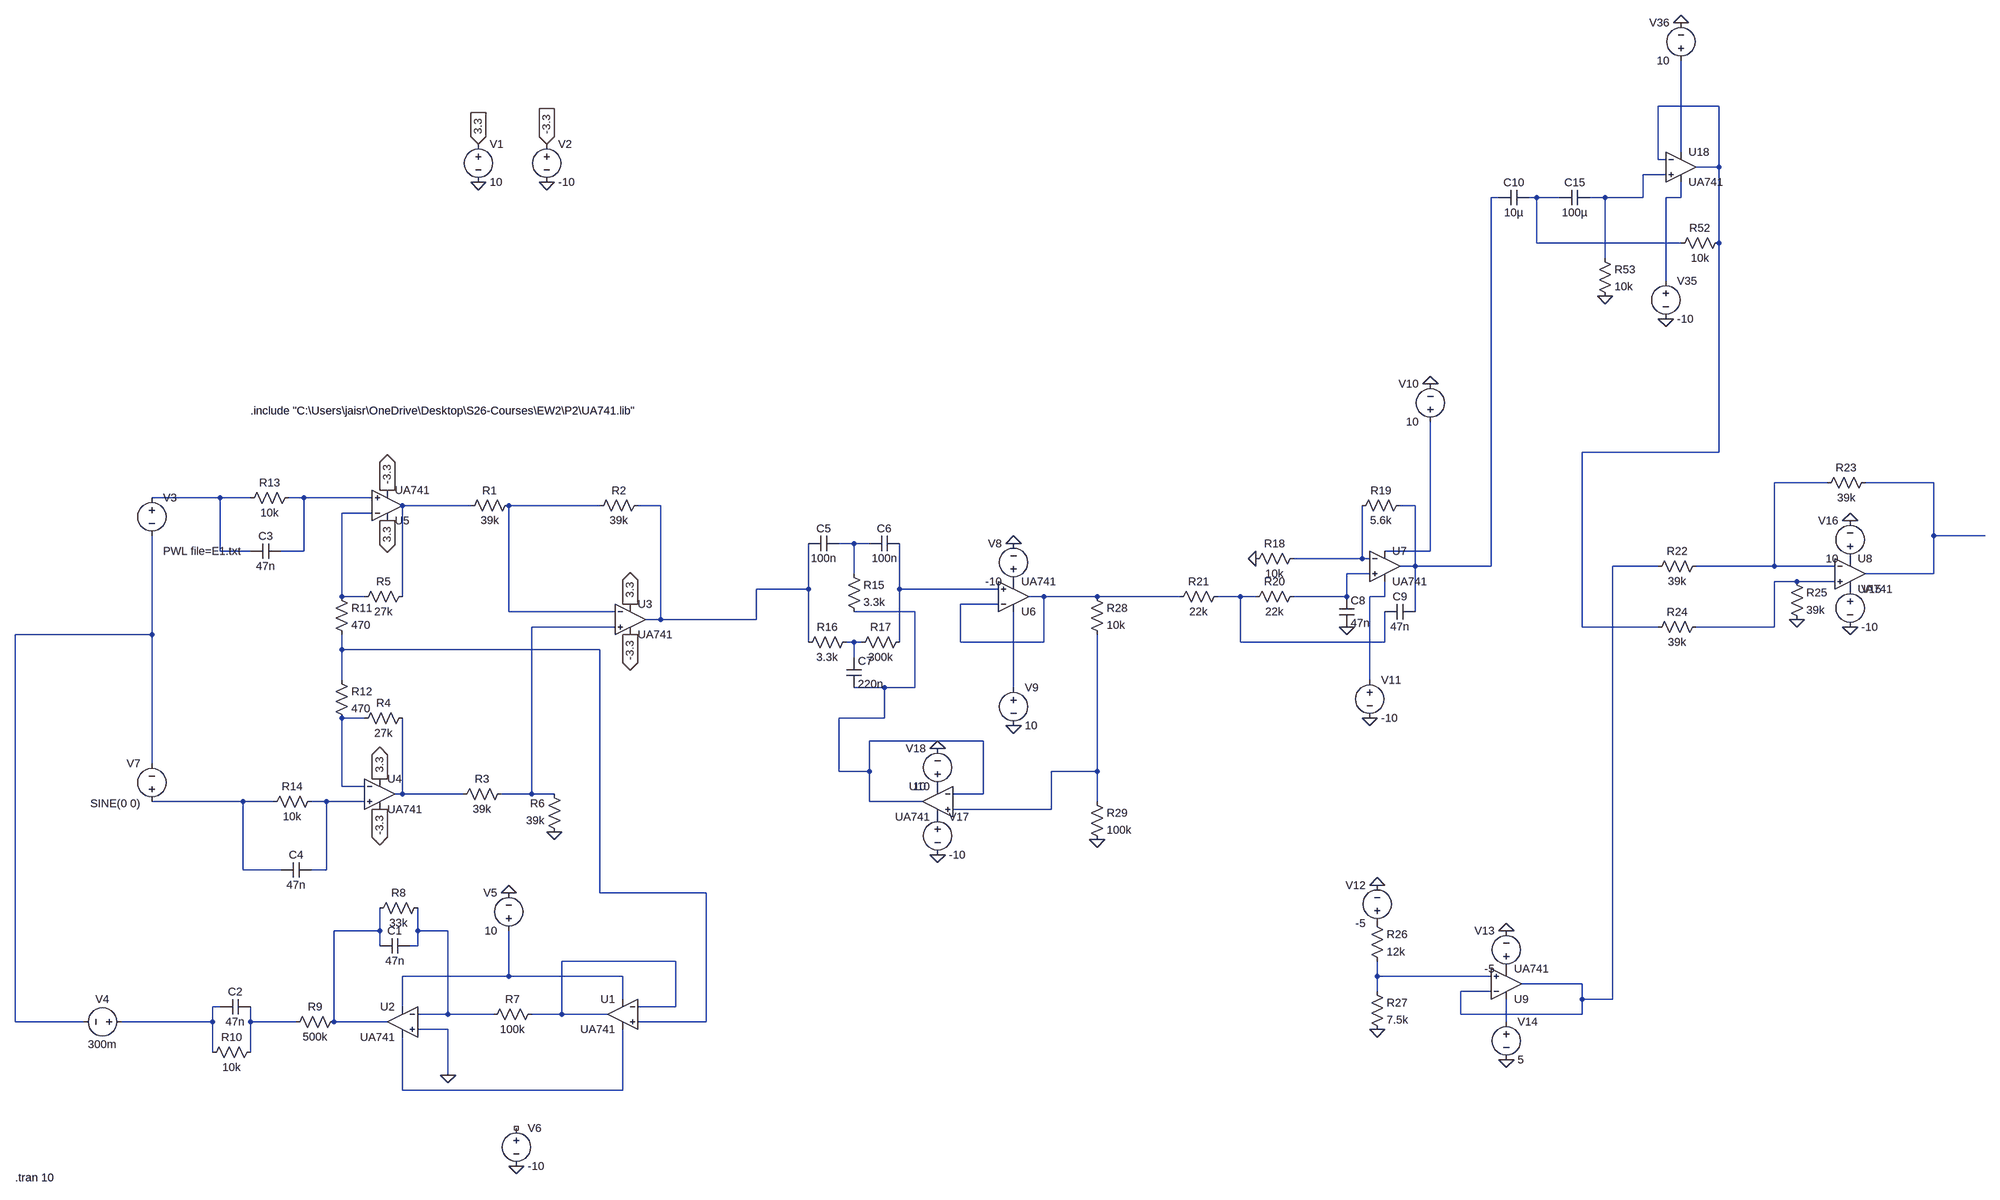
[diagram p0: schematic final ckt UA741.asc]
final ckt UA741.asc, the LTspice schematic file:
Version 4.1
SHEET 1 8580 3172
WIRE 4432 -1200 4304 -1200
WIRE 4352 -1104 4352 -1296
WIRE 4304 -1088 4304 -1200
WIRE 4320 -1088 4304 -1088
WIRE 4432 -1072 4432 -1200
WIRE 4432 -1072 4384 -1072
WIRE 4320 -1056 4272 -1056
WIRE 3968 -1008 3952 -1008
WIRE 4048 -1008 4032 -1008
WIRE 4096 -1008 4048 -1008
WIRE 4192 -1008 4160 -1008
WIRE 4272 -1008 4272 -1056
WIRE 4272 -1008 4192 -1008
WIRE 4352 -1008 4352 -1040
WIRE 4352 -1008 4320 -1008
WIRE 4048 -912 4048 -1008
WIRE 4352 -912 4048 -912
WIRE 4432 -912 4432 -1072
WIRE 4192 -880 4192 -1008
WIRE 4320 -832 4320 -1008
WIRE 4432 -336 4432 -912
WIRE 4432 -336 4144 -336
WIRE 4672 -272 4560 -272
WIRE 4896 -272 4752 -272
WIRE -816 -240 -960 -240
WIRE -752 -240 -816 -240
WIRE -640 -240 -672 -240
WIRE -496 -240 -640 -240
WIRE -288 -224 -432 -224
WIRE -16 -224 -208 -224
WIRE 112 -224 64 -224
WIRE 3792 -224 3760 -224
WIRE -496 -208 -560 -208
WIRE 4896 -160 4896 -272
WIRE 5456 -160 4896 -160
WIRE 2048 -144 2016 -144
WIRE 2080 -144 2048 -144
WIRE -816 -128 -816 -240
WIRE -752 -128 -816 -128
WIRE -640 -128 -640 -240
WIRE -640 -128 -688 -128
WIRE 3824 -128 3824 -400
WIRE 3824 -128 3728 -128
WIRE 3680 -112 3680 -224
WIRE 3680 -112 3536 -112
WIRE 3696 -112 3680 -112
WIRE 3792 -96 3792 -224
WIRE 3792 -96 3760 -96
WIRE 3952 -96 3952 -1008
WIRE 3952 -96 3792 -96
WIRE 4304 -96 4208 -96
WIRE 4560 -96 4560 -272
WIRE 4560 -96 4384 -96
WIRE 4688 -96 4560 -96
WIRE 2048 -80 2048 -144
WIRE 3696 -80 3648 -80
WIRE 4896 -80 4896 -160
WIRE 4896 -80 4752 -80
WIRE 4608 -64 4560 -64
WIRE 4688 -64 4608 -64
WIRE 1952 -48 1952 -144
WIRE 1952 -48 1024 -48
WIRE 2144 -48 2144 -144
WIRE 2352 -48 2144 -48
WIRE -560 -32 -560 -208
WIRE -512 -32 -560 -32
WIRE -432 -32 -432 -224
WIRE 2448 -32 2416 -32
WIRE 2560 -32 2448 -32
WIRE 3296 -32 2560 -32
WIRE 3424 -32 3376 -32
WIRE 3456 -32 3424 -32
WIRE 3648 -32 3648 -80
WIRE 3648 -32 3536 -32
WIRE 3728 -32 3728 -64
WIRE 3728 -32 3696 -32
WIRE 2352 -16 2272 -16
WIRE -208 0 -208 -224
WIRE 16 0 -208 0
WIRE 2176 0 2048 0
WIRE 3792 0 3792 -96
WIRE 112 16 112 -224
WIRE 112 16 80 16
WIRE 1024 16 1024 -48
WIRE 1024 16 112 16
WIRE 16 32 -160 32
WIRE 4144 32 4144 -336
WIRE 4304 32 4144 32
WIRE 4560 32 4560 -64
WIRE 4560 32 4384 32
WIRE -960 48 -960 -160
WIRE -960 48 -1248 48
WIRE 1952 64 1952 -48
WIRE 2048 64 2032 64
WIRE 2064 64 2048 64
WIRE 2144 64 2144 -48
WIRE 2272 64 2272 -16
WIRE 2448 64 2448 -32
WIRE 2448 64 2272 64
WIRE 3424 64 3424 -32
WIRE 3728 64 3728 0
WIRE 3728 64 3424 64
WIRE -560 80 -560 48
WIRE -16 80 -560 80
WIRE 2048 96 2048 64
WIRE -560 144 -560 80
WIRE 3696 144 3696 -32
WIRE 2112 160 2048 160
WIRE 2176 160 2176 0
WIRE 2176 160 2112 160
WIRE 2384 160 2384 0
WIRE -512 224 -560 224
WIRE 2112 224 2112 160
WIRE 2112 224 2016 224
WIRE 2320 272 2080 272
WIRE -960 320 -960 48
WIRE 2016 336 2016 224
WIRE 2080 336 2080 272
WIRE 2080 336 2016 336
WIRE 2560 336 2560 48
WIRE 2560 336 2464 336
WIRE -560 368 -560 224
WIRE -512 368 -560 368
WIRE -432 384 -432 224
WIRE -432 384 -448 384
WIRE -304 384 -432 384
WIRE -160 384 -160 32
WIRE -160 384 -224 384
WIRE -112 384 -160 384
WIRE 2320 384 2320 272
WIRE 2320 384 2256 384
WIRE -768 400 -960 400
WIRE -704 400 -768 400
WIRE -592 400 -624 400
WIRE -512 400 -592 400
WIRE 2080 400 2080 336
WIRE 2192 400 2080 400
WIRE 2560 400 2560 336
WIRE 2464 416 2464 336
WIRE 2464 416 2256 416
WIRE -768 544 -768 400
WIRE -688 544 -768 544
WIRE -592 544 -592 400
WIRE -592 544 -624 544
WIRE -16 592 -16 80
WIRE 208 592 -16 592
WIRE -480 672 -480 624
WIRE -480 672 -576 672
WIRE -400 672 -400 624
WIRE -336 672 -400 672
WIRE -480 704 -480 672
WIRE -400 704 -400 672
WIRE -400 704 -416 704
WIRE 144 736 -96 736
WIRE -208 768 -208 672
WIRE -208 768 -432 768
WIRE 32 768 -208 768
WIRE 3712 768 3712 736
WIRE 3952 768 3712 768
WIRE 4144 784 4016 784
WIRE 3712 800 3712 768
WIRE 3952 800 3888 800
WIRE 32 816 32 768
WIRE 4144 816 4144 784
WIRE 4208 816 4208 -96
WIRE 4208 816 4144 816
WIRE -816 832 -832 832
WIRE -432 832 -432 768
WIRE 144 832 144 736
WIRE 144 832 64 832
WIRE -336 848 -336 672
WIRE -336 848 -400 848
WIRE -240 848 -336 848
WIRE -96 848 -96 736
WIRE -96 848 -160 848
WIRE 0 848 -96 848
WIRE 3888 848 3888 800
WIRE 4144 848 4144 816
WIRE 4144 848 3888 848
WIRE -1248 864 -1248 48
WIRE -1104 864 -1248 864
WIRE -832 864 -832 832
WIRE -832 864 -1024 864
WIRE -752 864 -752 832
WIRE -656 864 -752 864
WIRE -576 864 -576 672
WIRE -464 864 -576 864
WIRE 208 864 208 592
WIRE 208 864 64 864
WIRE 3984 864 3984 816
WIRE -336 880 -400 880
WIRE -832 928 -832 864
WIRE -752 928 -752 864
WIRE -336 976 -336 880
WIRE -432 1008 -432 896
WIRE 32 1008 32 880
WIRE 32 1008 -432 1008
FLAG -272 -1040 0
FLAG -128 -1040 0
FLAG -272 -1120 3.3
IOPIN -272 -1120 In
FLAG -128 -1120 -3.3
IOPIN -128 -1120 In
FLAG -112 464 0
FLAG -464 -192 3.3
IOPIN -464 -192 Out
FLAG -480 352 3.3
IOPIN -480 352 Out
FLAG -464 -256 -3.3
IOPIN -464 -256 Out
FLAG -480 416 -3.3
IOPIN -480 416 Out
FLAG 48 -16 3.3
IOPIN 48 -16 Out
FLAG 48 48 -3.3
IOPIN 48 48 Out
FLAG -336 976 0
FLAG -192 1168 0
FLAG -208 592 0
FLAG 2384 240 0
FLAG 2384 -144 0
FLAG 2560 480 0
FLAG 2224 512 0
FLAG 2224 288 0
FLAG 3648 32 0
FLAG 3456 -112 0
FLAG 3696 224 0
FLAG 3824 -480 0
FLAG 4608 16 0
FLAG 3712 880 0
FLAG 3712 576 0
FLAG 3984 944 0
FLAG 3984 672 0
FLAG 4720 -192 0
FLAG 4720 32 0
FLAG 4320 -752 0
FLAG 4352 -1376 0
FLAG 4192 -800 0
SYMBOL voltage -272 -1136 R0
WINDOW 123 0 0 Left 0
WINDOW 39 0 0 Left 0
SYMATTR InstName V1
SYMATTR Value 10
SYMBOL voltage -128 -1136 R0
WINDOW 123 0 0 Left 0
WINDOW 39 0 0 Left 0
SYMATTR InstName V2
SYMATTR Value -10
SYMBOL res -192 -240 R90
WINDOW 0 0 56 VBottom 2
WINDOW 3 32 56 VTop 2
SYMATTR InstName R1
SYMATTR Value 39k
SYMBOL res 80 -240 R90
WINDOW 0 0 56 VBottom 2
WINDOW 3 32 56 VTop 2
SYMATTR InstName R2
SYMATTR Value 39k
SYMBOL res -208 368 R90
WINDOW 0 0 56 VBottom 2
WINDOW 3 32 56 VTop 2
SYMATTR InstName R3
SYMATTR Value 39k
SYMBOL res -416 208 R90
WINDOW 0 0 56 VBottom 2
WINDOW 3 32 56 VTop 2
SYMATTR InstName R4
SYMATTR Value 27k
SYMBOL res -416 -48 R90
WINDOW 0 0 56 VBottom 2
WINDOW 3 32 56 VTop 2
SYMATTR InstName R5
SYMATTR Value 27k
SYMBOL res -96 480 R180
WINDOW 0 36 76 Left 2
WINDOW 3 36 40 Left 2
SYMATTR InstName R6
SYMATTR Value 39k
SYMBOL voltage -960 -256 R0
WINDOW 123 24 100 Left 2
WINDOW 39 0 0 Left 0
WINDOW 3 24 128 Left 2
SYMATTR Value PWL file=E1.txt
SYMATTR InstName V3
SYMBOL OpAmps\\opamp2 32 784 M0
SYMATTR InstName U1
SYMATTR Value UA741
SYMBOL OpAmps\\opamp2 -432 800 M0
SYMATTR InstName U2
SYMATTR Value UA741
SYMBOL res -144 832 R90
WINDOW 0 0 56 VBottom 2
WINDOW 3 32 56 VTop 2
SYMATTR InstName R7
SYMATTR Value 100k
SYMBOL cap -416 688 R90
WINDOW 0 0 32 VBottom 2
WINDOW 3 32 32 VTop 2
SYMATTR InstName C1
SYMATTR Value 47n
SYMBOL res -384 608 R90
WINDOW 0 0 56 VBottom 2
WINDOW 3 32 56 VTop 2
SYMATTR InstName R8
SYMATTR Value 33k
SYMBOL res -560 848 R90
WINDOW 0 0 56 VBottom 2
WINDOW 3 32 56 VTop 2
SYMATTR InstName R9
SYMATTR Value 500k
SYMBOL cap -752 816 R90
WINDOW 0 0 32 VBottom 2
WINDOW 3 32 32 VTop 2
SYMATTR InstName C2
SYMATTR Value 47n
SYMBOL res -736 912 R90
WINDOW 0 0 56 VBottom 2
WINDOW 3 32 56 VTop 2
SYMATTR InstName R10
SYMATTR Value 10k
SYMBOL voltage -1008 864 R90
WINDOW 0 -32 56 VBottom 2
WINDOW 3 32 56 VTop 2
WINDOW 123 0 0 Left 0
WINDOW 39 0 0 Left 0
SYMATTR InstName V4
SYMATTR Value 300m
SYMBOL voltage -208 688 R180
WINDOW 0 24 96 Left 2
WINDOW 3 24 16 Left 2
WINDOW 123 0 0 Left 0
WINDOW 39 0 0 Left 0
SYMATTR InstName V5
SYMATTR Value 10
SYMBOL voltage -192 1072 R0
WINDOW 123 0 0 Left 0
WINDOW 39 0 0 Left 0
SYMATTR InstName V6
SYMATTR Value -10
SYMBOL res -576 -48 R0
SYMATTR InstName R11
SYMATTR Value 470
SYMBOL res -576 128 R0
SYMATTR InstName R12
SYMATTR Value 470
SYMBOL res -656 -256 R90
WINDOW 0 0 56 VBottom 2
WINDOW 3 32 56 VTop 2
SYMATTR InstName R13
SYMATTR Value 10k
SYMBOL res -608 384 R90
WINDOW 0 0 56 VBottom 2
WINDOW 3 32 56 VTop 2
SYMATTR InstName R14
SYMATTR Value 10k
SYMBOL cap -688 -144 R90
WINDOW 0 0 32 VBottom 2
WINDOW 3 32 32 VTop 2
SYMATTR InstName C3
SYMATTR Value 47n
SYMBOL cap -624 528 R90
WINDOW 0 0 32 VBottom 2
WINDOW 3 32 32 VTop 2
SYMATTR InstName C4
SYMATTR Value 47n
SYMBOL voltage -960 416 R180
WINDOW 0 24 96 Left 2
WINDOW 3 24 12 Left 2
WINDOW 123 24 40 Left 2
WINDOW 39 0 0 Left 0
SYMATTR InstName V7
SYMATTR Value SINE(0 0)
SYMBOL cap 2016 -160 R90
WINDOW 0 0 32 VBottom 2
WINDOW 3 32 32 VTop 2
SYMATTR InstName C5
SYMATTR Value 100n
SYMBOL cap 2144 -160 R90
WINDOW 0 0 32 VBottom 2
WINDOW 3 32 32 VTop 2
SYMATTR InstName C6
SYMATTR Value 100n
SYMBOL res 2032 -96 R0
SYMATTR InstName R15
SYMATTR Value 3.3k
SYMBOL res 2048 48 R90
WINDOW 0 0 56 VBottom 2
WINDOW 3 32 56 VTop 2
SYMATTR InstName R16
SYMATTR Value 3.3k
SYMBOL res 2160 48 R90
WINDOW 0 0 56 VBottom 2
WINDOW 3 32 56 VTop 2
SYMATTR InstName R17
SYMATTR Value 300k
SYMBOL cap 2032 96 R0
SYMATTR InstName C7
SYMATTR Value 220n
SYMBOL voltage 2384 -48 R180
WINDOW 0 24 96 Left 2
WINDOW 3 24 16 Left 2
WINDOW 123 0 0 Left 0
WINDOW 39 0 0 Left 0
SYMATTR InstName V8
SYMATTR Value -10
SYMBOL voltage 2384 144 R0
WINDOW 123 0 0 Left 0
WINDOW 39 0 0 Left 0
SYMATTR InstName V9
SYMATTR Value 10
SYMBOL OpAmps\\opamp2 -480 320 R0
SYMATTR InstName U4
SYMATTR Value UA741
SYMBOL OpAmps\\opamp2 -464 -160 M180
SYMATTR InstName U5
SYMATTR Value UA741
SYMBOL OpAmps\\opamp2 48 -48 R0
SYMATTR InstName U3
SYMATTR Value UA741
SYMBOL OpAmps\\opamp2 2384 32 M180
SYMATTR InstName U6
SYMATTR Value UA741
SYMBOL res 2544 -48 R0
SYMATTR InstName R28
SYMATTR Value 10k
SYMBOL res 2544 384 R0
SYMATTR InstName R29
SYMATTR Value 100k
SYMBOL OpAmps\\opamp2 2224 336 M0
SYMATTR InstName U10
SYMATTR Value UA741
SYMBOL voltage 2224 416 R0
WINDOW 123 0 0 Left 0
WINDOW 39 0 0 Left 0
SYMATTR InstName V17
SYMATTR Value -10
SYMBOL voltage 2224 384 R180
WINDOW 0 24 96 Left 2
WINDOW 3 24 16 Left 2
WINDOW 123 0 0 Left 0
WINDOW 39 0 0 Left 0
SYMATTR InstName V18
SYMATTR Value 10
SYMBOL OpAmps\\opamp2 3728 -160 R0
SYMATTR InstName U7
SYMATTR Value UA741
SYMBOL res 3552 -128 R90
WINDOW 0 0 56 VBottom 2
WINDOW 3 32 56 VTop 2
SYMATTR InstName R18
SYMATTR Value 10k
SYMBOL res 3776 -240 R90
WINDOW 0 0 56 VBottom 2
WINDOW 3 32 56 VTop 2
SYMATTR InstName R19
SYMATTR Value 5.6k
SYMBOL res 3552 -48 R90
WINDOW 0 0 56 VBottom 2
WINDOW 3 32 56 VTop 2
SYMATTR InstName R20
SYMATTR Value 22k
SYMBOL res 3392 -48 R90
WINDOW 0 0 56 VBottom 2
WINDOW 3 32 56 VTop 2
SYMATTR InstName R21
SYMATTR Value 22k
SYMBOL cap 3632 -32 R0
SYMATTR InstName C8
SYMATTR Value 47n
SYMBOL cap 3792 -16 R90
WINDOW 0 0 32 VBottom 2
WINDOW 3 32 32 VTop 2
SYMATTR InstName C9
SYMATTR Value 47n
SYMBOL voltage 3824 -384 R180
WINDOW 0 24 96 Left 2
WINDOW 3 24 16 Left 2
WINDOW 123 0 0 Left 0
WINDOW 39 0 0 Left 0
SYMATTR InstName V10
SYMATTR Value 10
SYMBOL voltage 3696 128 R0
WINDOW 123 0 0 Left 0
WINDOW 39 0 0 Left 0
SYMATTR InstName V11
SYMATTR Value -10
SYMBOL OpAmps\\opamp2 4720 -144 R0
SYMATTR InstName U8
SYMATTR Value UA741
SYMBOL res 4400 -112 R90
WINDOW 0 0 56 VBottom 2
WINDOW 3 32 56 VTop 2
SYMATTR InstName R22
SYMATTR Value 39k
SYMBOL res 4768 -288 R90
WINDOW 0 0 56 VBottom 2
WINDOW 3 32 56 VTop 2
SYMATTR InstName R23
SYMATTR Value 39k
SYMBOL res 4400 16 R90
WINDOW 0 0 56 VBottom 2
WINDOW 3 32 56 VTop 2
SYMATTR InstName R24
SYMATTR Value 39k
SYMBOL res 4592 -80 R0
SYMATTR InstName R25
SYMATTR Value 39k
SYMBOL res 3696 640 R0
SYMATTR InstName R26
SYMATTR Value 12k
SYMBOL res 3696 784 R0
SYMATTR InstName R27
SYMATTR Value 7.5k
SYMBOL voltage 3712 672 R180
WINDOW 0 24 96 Left 2
WINDOW 3 24 16 Left 2
WINDOW 123 0 0 Left 0
WINDOW 39 0 0 Left 0
SYMATTR InstName V12
SYMATTR Value -5
SYMBOL OpAmps\\opamp2 3984 848 M180
SYMATTR InstName U9
SYMATTR Value UA741
SYMBOL voltage 3984 768 R180
WINDOW 0 24 96 Left 2
WINDOW 3 24 16 Left 2
WINDOW 123 0 0 Left 0
WINDOW 39 0 0 Left 0
SYMATTR InstName V13
SYMATTR Value -5
SYMBOL voltage 3984 848 R0
WINDOW 123 0 0 Left 0
WINDOW 39 0 0 Left 0
SYMATTR InstName V14
SYMATTR Value 5
SYMBOL voltage 4720 -64 R0
WINDOW 123 0 0 Left 0
WINDOW 39 0 0 Left 0
SYMATTR InstName V15
SYMATTR Value -10
SYMBOL voltage 4720 -96 R180
WINDOW 0 24 96 Left 2
WINDOW 3 24 16 Left 2
WINDOW 123 0 0 Left 0
WINDOW 39 0 0 Left 0
SYMATTR InstName V16
SYMATTR Value 10
SYMBOL OpAmps\\opamp2 4352 -1136 R0
SYMATTR InstName U18
SYMATTR Value UA741
SYMBOL voltage 4320 -848 R0
WINDOW 123 0 0 Left 0
WINDOW 39 0 0 Left 0
SYMATTR InstName V35
SYMATTR Value -10
SYMBOL res 4448 -928 R90
WINDOW 0 0 56 VBottom 2
WINDOW 3 32 56 VTop 2
SYMATTR InstName R52
SYMATTR Value 10k
SYMBOL voltage 4352 -1280 R180
WINDOW 0 24 96 Left 2
WINDOW 3 24 16 Left 2
WINDOW 123 0 0 Left 0
WINDOW 39 0 0 Left 0
SYMATTR InstName V36
SYMATTR Value 10
SYMBOL res 4176 -896 R0
SYMATTR InstName R53
SYMATTR Value 10k
SYMBOL cap 4160 -1024 R90
WINDOW 0 0 32 VBottom 2
WINDOW 3 32 32 VTop 2
SYMATTR InstName C15
SYMATTR Value 100µ
SYMBOL cap 4032 -1024 R90
WINDOW 0 0 32 VBottom 2
WINDOW 3 32 32 VTop 2
SYMATTR InstName C10
SYMATTR Value 10µ
TEXT -752 -424 Left 2 !.include "C:\\Users\\jaisr\\OneDrive\\Desktop\\S26-Courses\\EW2\\P2\\UA741.lib"
TEXT -1248 1192 Left 2 !.tran 10

The netlist it stands for:
* final ckt UA741.asc
V1 3.3 0 10
V2 -3.3 0 -10
R1 N012 N011 39k
R2 N013 N012 39k
R3 N026 N033 39k
R4 N033 N031 27k
R5 N011 N014 27k
R6 0 N026 39k
V3 N009 N027 PWL file=E1.txt
X§U1 N029 N038 N039 N044 N038 UA741  ; pins In+ In- V+ V- OUT
X§U2 0 N037 N039 N044 N036 UA741  ; pins In+ In- V+ V- OUT
R7 N038 N037 100k
C1 N037 N036 47n
R8 N037 N036 33k
R9 N036 N042 500k
C2 N042 N041 47n
R10 N042 N041 10k
V4 N041 N027 300m
V5 N039 0 10
V6 NC_01 0 -10
R11 N014 N029 470
R12 N029 N031 470
R13 N010 N009 10k
R14 N035 N034 10k
C3 N010 N009 47n
C4 N035 N034 47n
V7 N034 N027 SINE(0 0)
C5 N015 N013 100n
C6 N021 N015 100n
R15 N015 N025 3.3k
R16 N028 N013 3.3k
R17 N021 N028 300k
C7 N028 N025 220n
V8 P001 0 -10
V9 N030 0 10
X§U4 N035 N031 3.3 -3.3 N033 UA741  ; pins In+ In- V+ V- OUT
X§U5 N010 N014 3.3 -3.3 N011 UA741  ; pins In+ In- V+ V- OUT
X§U3 N026 N012 3.3 -3.3 N013 UA741  ; pins In+ In- V+ V- OUT
X§U6 N021 N022 N030 P001 N022 UA741  ; pins In+ In- V+ V- OUT
R28 N022 N032 10k
R29 N032 0 100k
X§U10 N032 N025 P002 P003 N025 UA741  ; pins In+ In- V+ V- OUT
V17 P003 0 -10
V18 P002 0 10
X§U7 N019 N017 N016 N024 N004 UA741  ; pins In+ In- V+ V- OUT
R18 N017 0 10k
R19 N004 N017 5.6k
R20 N019 N023 22k
R21 N023 N022 22k
C8 N019 0 47n
C9 N004 N023 47n
V10 N016 0 10
V11 N024 0 -10
X§U8 N020 N007 P004 P005 N008 UA741  ; pins In+ In- V+ V- OUT
R22 N007 N018 39k
R23 N008 N007 39k
R24 N020 N001 39k
R25 N020 0 39k
R26 P006 N040 12k
R27 N040 0 7.5k
V12 P006 0 -5
X§U9 N040 N018 N043 P007 N018 UA741  ; pins In+ In- V+ V- OUT
V13 P007 0 -5
V14 N043 0 5
V15 P005 0 -10
V16 P004 0 10
X§U18 N003 N001 N002 N006 N001 UA741  ; pins In+ In- V+ V- OUT
V35 N006 0 -10
R52 N001 N005 10k
V36 N002 0 10
R53 N003 0 10k
C15 N003 N005 100µ
C10 N005 N004 10µ
.include "C:\Users\jaisr\OneDrive\Desktop\S26-Courses\EW2\P2\UA741.lib"
.tran 10
.backanno
.end